# Altium schematic sheet 04_Mcu.SchDoc
size A4
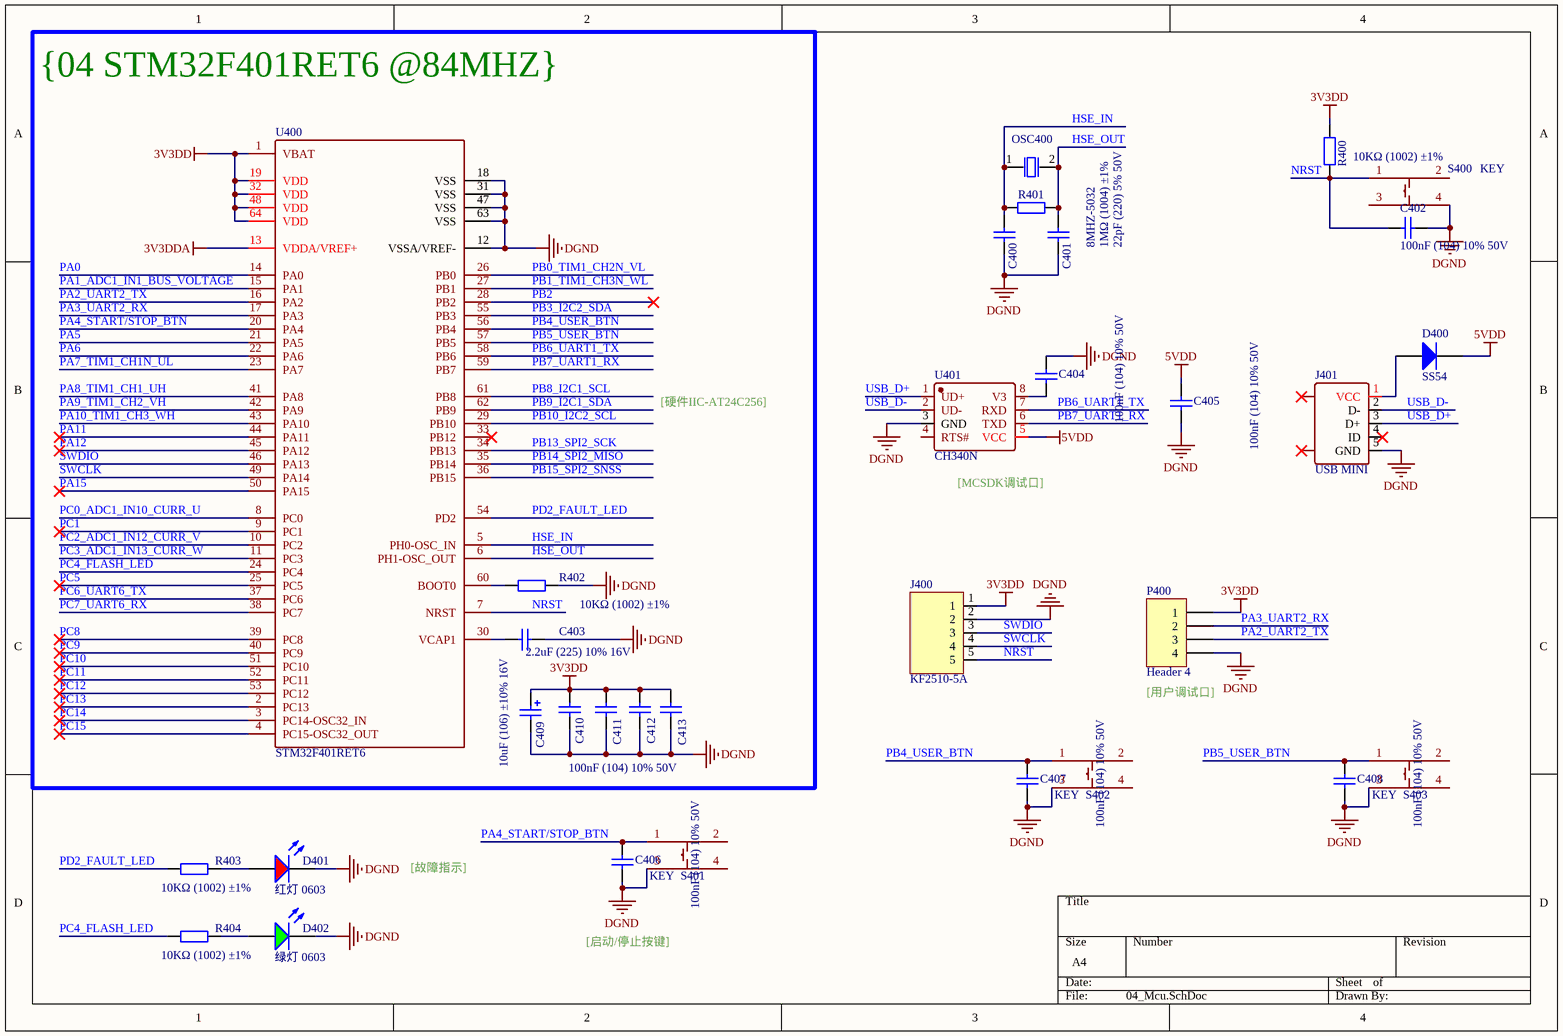
[diagram p0: 04_Mcu.SchDoc]

## Parts
C400  22pF (220) 5% 50V  [LC-0603_C]
C401  22pF (220) 5% 50V  [LC-0603_C]  (value not drawn)
C402  100nF (104) 10% 50V  [LC-0603_C]
C403  2.2uF (225) 10% 16V  [LC-0603_C]
C404  100nF (104) 10% 50V  [LC-0603_C]
C405  100nF (104) 10% 50V  [LC-0603_C]
C406  100nF (104) 10% 50V  [LC-0603_C]
C407  100nF (104) 10% 50V  [LC-0603_C]
C408  100nF (104) 10% 50V  [LC-0603_C]
C409  10uF (106) ±10% 16V  [LC-CASE-A_3216]
C410  100nF (104) 10% 50V  [LC-0603_C]
C411  100nF (104) 10% 50V  [LC-0603_C]  (value not drawn)
C412  100nF (104) 10% 50V  [LC-0603_C]  (value not drawn)
C413  100nF (104) 10% 50V  [LC-0603_C]  (value not drawn)
D400  SS54  [SS54]
D401  红灯 0603  [LC-0603_LED_S1]
D402  绿灯 0603  [LC-0603_LED_S1]
J400  KF2510-5A  [KF2510-5A]
J401  USB MINI  [USB_MINI]
OSC400  8MHZ-5032  [8MHZ-5032]
P400  Header 4  [2.54_4P_PIN]
R400  10KΩ (1002) ±1%  [LC-0603_R]
R401  1MΩ (1004) ±1%  [LC-0603_R]
R402  10KΩ (1002) ±1%  [LC-0603_R]
R403  10KΩ (1002) ±1%  [LC-0603_R]
R404  10KΩ (1002) ±1%  [LC-0603_R]
S400  KEY  [KEY_WHITE]
S401  KEY  [KEY_WHITE]
S402  KEY  [KEY_WHITE]
S403  KEY  [KEY_WHITE]
U400  STM32F401RET6  [STM32F401RET6]
U401  CH340N  [CH340N]

## Blocks framed on the sheet
{04 STM32F401RET6 @84MHZ}: C403 C409-C413 R402 U400

## Nets
3V3DD: C409.1 C410.2 C411.2 C412.2 C413.2 J400.1 P400.1 R400.2 U400.1(VBAT) U400.19(VDD) U400.32(VDD) U400.48(VDD) U400.64(VDD)
3V3DDA: U400.13(VDDA/VREF+)
5VDD: C405.2 D400.2(K) U401.5(VCC)
DGND: C400.1 C401.1 C402.1 C403.1 C404.2 C405.1 C406.1 C407.1 C408.1 C409.2 C410.1 C411.1 C412.1 C413.1 D401.K D402.K J400.2 J401.5(GND) P400.4 R402.2 S400.4 S401.3 S402.3 S403.3 U400.12(VSSA/VREF-) U400.18(VSS) U400.31(VSS) U400.47(VSS) U400.63(VSS) U401.3(GND)
HSE_IN: C400.2 OSC400.1(OSC1) R401.1 U400.5(PH0-OSC_IN)
HSE_OUT: C401.2 OSC400.2(OSC2) R401.2 U400.6(PH1-OSC_OUT)
NRST: C402.2 J400.5 R400.1 S400.1 U400.7(NRST)
PA0: U400.14(PA0)
PA1_ADC1_IN1_BUS_VOLTAGE: U400.15(PA1)
PA2_UART2_TX: P400.3 U400.16(PA2)
PA3_UART2_RX: P400.2 U400.17(PA3)
PA4_START/STOP_BTN: C406.2 S401.1 U400.20(PA4)
PA5: U400.21(PA5)
PA6: U400.22(PA6)
PA7_TIM1_CH1N_UL: U400.23(PA7)
PA8_TIM1_CH1_UH: U400.41(PA8)
PA9_TIM1_CH2_VH: U400.42(PA9)
PA10_TIM1_CH3_WH: U400.43(PA10)
PA11: U400.44(PA11)
PA12: U400.45(PA12)
PA15: U400.50(PA15)
PB0_TIM1_CH2N_VL: U400.26(PB0)
PB1_TIM1_CH3N_WL: U400.27(PB1)
PB2: U400.28(PB2)
PB3_I2C2_SDA: U400.55(PB3)
PB4_USER_BTN: C407.2 S402.1 U400.56(PB4)
PB5_USER_BTN: C408.2 S403.1 U400.57(PB5)
PB6_UART1_TX: U400.58(PB6) U401.7(RXD)
PB7_UART1_RX: U400.59(PB7) U401.6(TXD)
PB8_I2C1_SCL: U400.61(PB8)
PB9_I2C1_SDA: U400.62(PB9)
PB10_I2C2_SCL: U400.29(PB10)
PB13_SPI2_SCK: U400.34(PB13)
PB14_SPI2_MISO: U400.35(PB14)
PB15_SPI2_SNSS: U400.36(PB15)
PC0_ADC1_IN10_CURR_U: U400.8(PC0)
PC1: U400.9(PC1)
PC2_ADC1_IN12_CURR_V: U400.10(PC2)
PC3_ADC1_IN13_CURR_W: U400.11(PC3)
PC4_FLASH_LED: R404.1 U400.24(PC4)
PC5: U400.25(PC5)
PC6_UART6_TX: U400.37(PC6)
PC7_UART6_RX: U400.38(PC7)
PC8: U400.39(PC8)
PC9: U400.40(PC9)
PC10: U400.51(PC10)
PC11: U400.52(PC11)
PC12: U400.53(PC12)
PC13: U400.2(PC13)
PC14: U400.3(PC14-OSC32_IN)
PC15: U400.4(PC15-OSC32_OUT)
PD2_FAULT_LED: R403.1 U400.54(PD2)
SWCLK: J400.4 U400.49(PA14)
SWDIO: J400.3 U400.46(PA13)
USB_D+: J401.3(D+) U401.1(UD+)
USB_D-: J401.2(D-) U401.2(UD-)
NetC403_2: C403.2 U400.30(VCAP1)
NetC404_1: C404.1 U401.8(V3)
NetD400_1: D400.1(A) J401.1(VCC)
NetD401_A: D401.A R403.2
NetD402_A: D402.A R404.2
NetR402_1: R402.1 U400.60(BOOT0)

Not connected (* = marked no-connect by the designer): J401 0* 4(ID)*; S400 2 3; S401 2 4; S402 2 4; S403 2 4; U400 33(PB12)*; U401 4(RTS#)

## Notes on the sheet
- [硬件IIC-AT24C256]
- (near U401) [MCSDK调试口]
- (near P400) [用户调试口]
- [故障指示]
- [启动/停止按键]

## Library data of the parts
C400 C401 = 0603 22pF (220) 5% 50V: 贴片电容; ComponentLink1Description: 供应商链接; ComponentLink1URL: http://www.szlcsc.com/product/details_2005.html; Package: 0603; Supplier: LC; SuppliersPartNumber: C1653
C402 C404-C408 C410-C413 = 0603 100nF (104) 10% 50V: 贴片电容; ComponentLink1Description: 供应商链接; ComponentLink1URL: http://www.szlcsc.com/product/details_15331.html; Package: 0603; Supplier: LC; SuppliersPartNumber: C14663
C403 = 0603 2.2uF (225) 10% 16V: 贴片电容; ComponentLink1Description: 供应商链接; ComponentLink1URL: http://www.szlcsc.com/product/details_24366.html; Package: 0603; Supplier: LC; SuppliersPartNumber: C23630
C409 = 3216 10uF (106) 10% 16V: 钽电容; ComponentLink1Description: 供应商链接; ComponentLink1URL: http://www.szlcsc.com/product/details_7643.html; Package: 3216; Supplier: LC; SuppliersPartNumber: C7171
D400 = SMA(DO-214AC) SS54: 二极管; ComponentLink1Description: 供应商链接; ComponentLink1URL: http://www.szlcsc.com/product/details_23178.html; Package: SMA(DO-214AC); Supplier: LC; SuppliersPartNumber: C22452
D401 = 0603 红灯: 发光二极管; ComponentLink1Description: 供应商链接; ComponentLink1URL: http://www.szlcsc.com/product/details_2659.html; Package: 0603; Supplier: LC; SuppliersPartNumber: C2286
D402 = 0603 绿灯: 发光二极管; ComponentLink1Description: 供应商链接; ComponentLink1URL: http://www.szlcsc.com/product/details_73152.html; Package: 0603; Supplier: LC; SuppliersPartNumber: C72043
P400 = Header 4: Header, 4-Pin; LatestRevisionDate: 17-Jul-2002; LatestRevisionNote: Re-released for DXP Platform.; Publisher: Altium Limited
R400 R402-R404 = 0603 10KΩ (1002) 1%: 贴片电阻; ComponentLink1Description: 供应商链接; ComponentLink1URL: http://www.szlcsc.com/product/details_26547.html; Package: 0603; Supplier: LC; SuppliersPartNumber: C25804
R401 = 0603 1MΩ (1004) 1%: 贴片电阻; ComponentLink1Description: 供应商链接; ComponentLink1URL: http://www.szlcsc.com/product/details_23662.html; Package: 0603; Supplier: LC; SuppliersPartNumber: C22935
S400-S403 = KEY: 白色方块